# Altium project TC-temp-logger-base.PrjPcb (part 2 of 2)

## Sheet 4-Ethernet.SchDoc: Thermocouple Temperature Logger
size A4; Date: 14.03.2026; Author: MG & JK; Revision: 1-0; SheetNumber: 4; SheetTotal: 7; Model: Rev 1.0; PageSetup: Record=PageOptions|CenterHorizontal=True|CenterVertical=True|PrintScale=0.52|XCorrection=1.00|YCorrection=1.00|PrintKind=1|BorderSize=5000000|LeftOffset=0|BottomOffset=0|Orientation=2|PaperLength=4200|PaperWidth=2970|Scale=100|PaperSource=7|PrintQuality=600|MediaType=1|DitherType=10|PaperKind=A3|PrintScaleMode=1
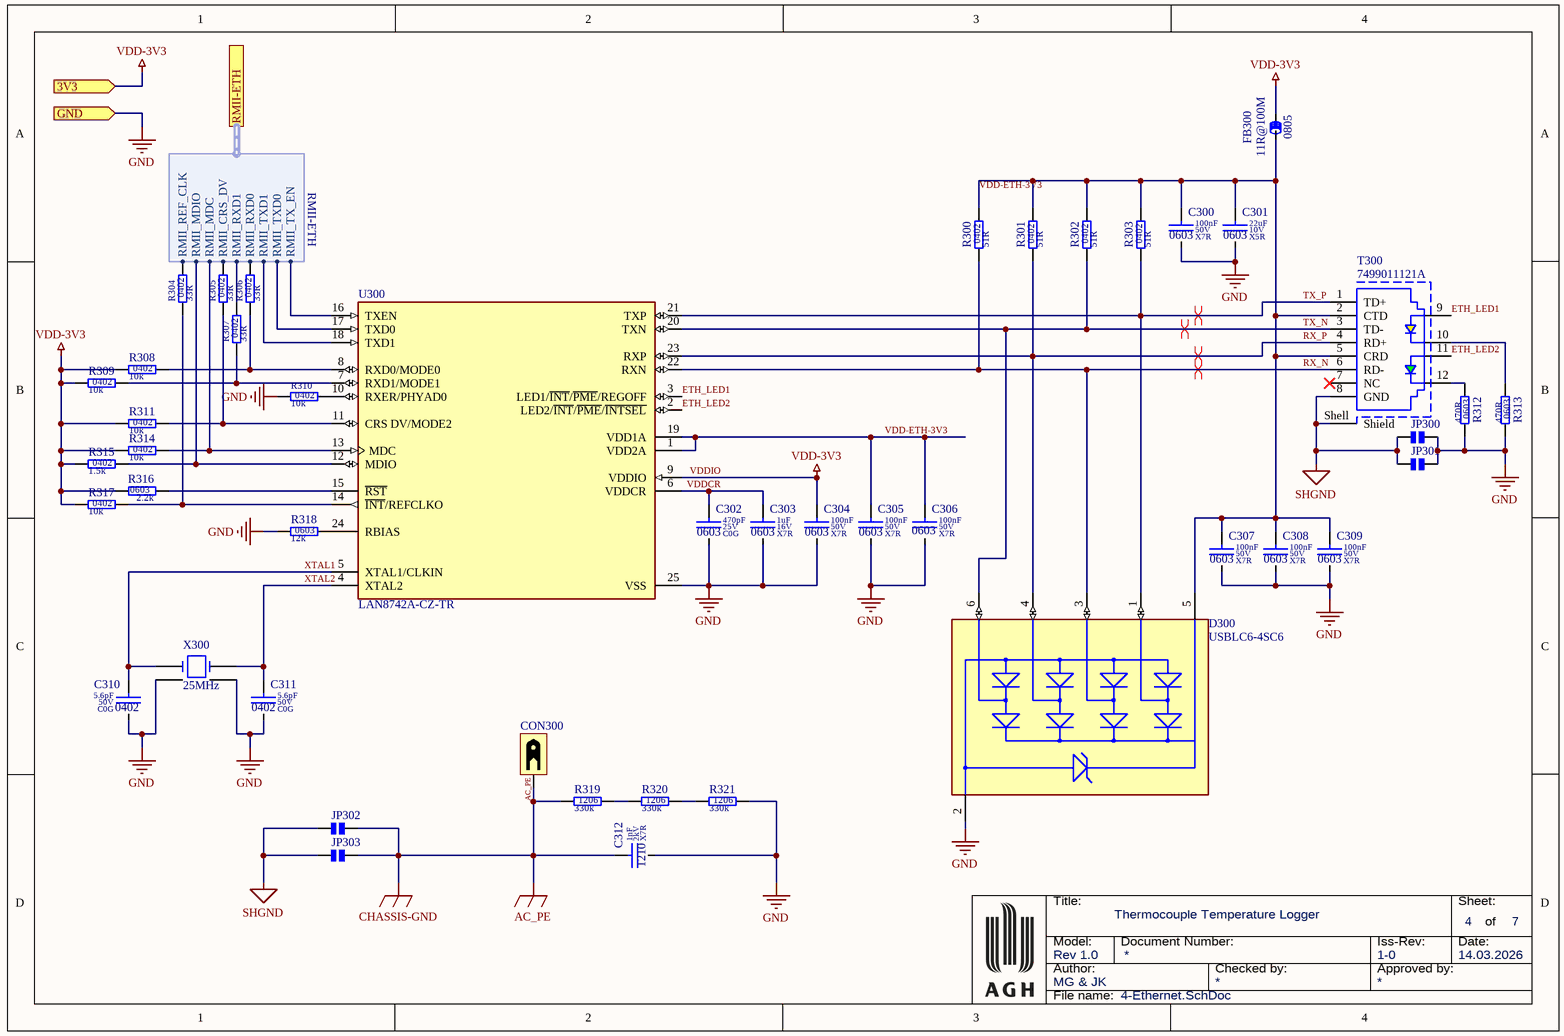
[diagram p3: 4-Ethernet.SchDoc]

### Parts
C300  value 100nF  Dielectric: X7R  Voltage: 50V  SCH_Footprint: 0603  [C_0603_1608]  (hidden comment: Ceramic X7R)
C301  value 22uF  Dielectric: X5R  Voltage: 10V  SCH_Footprint: 0603  [C_0603_1608]  (hidden comment: Ceramic X5R)
C302  value 470pF  Dielectric: C0G  Voltage: 25V  SCH_Footprint: 0603  [C_0603_1608]  (hidden comment: Ceramic C0G)
C303  value 1uF  Dielectric: X7R  Voltage: 16V  SCH_Footprint: 0603  [C_0603_1608]  (hidden comment: Ceramic X7R)
C304  value 100nF  Dielectric: X7R  Voltage: 50V  SCH_Footprint: 0603  [C_0603_1608]  (hidden comment: Ceramic X7R)
C305  value 100nF  Dielectric: X7R  Voltage: 50V  SCH_Footprint: 0603  [C_0603_1608]  (hidden comment: Ceramic X7R)
C306  value 100nF  Dielectric: X7R  Voltage: 50V  SCH_Footprint: 0603  [C_0603_1608]  (hidden comment: Ceramic X7R)
C307  value 100nF  Dielectric: X7R  Voltage: 50V  SCH_Footprint: 0603  [C_0603_1608]  (hidden comment: Ceramic X7R)
C308  value 100nF  Dielectric: X7R  Voltage: 50V  SCH_Footprint: 0603  [C_0603_1608]  (hidden comment: Ceramic X7R)
C309  value 100nF  Dielectric: X7R  Voltage: 50V  SCH_Footprint: 0603  [C_0603_1608]  (hidden comment: Ceramic X7R)
C310  value 5.6pF  Dielectric: C0G  Voltage: 50V  SCH_Footprint: 0402  [C_0402_1005]  (hidden comment: Ceramic C0G)
C311  value 5.6pF  Dielectric: C0G  Voltage: 50V  SCH_Footprint: 0402  [C_0402_1005]  (hidden comment: Ceramic C0G)
C312  value 1nF  Dielectric: X7R  Voltage: 2kV  SCH_Footprint: 1210  [C_1210_3225]  (hidden comment: Ceramic X7R)
CON300  Terminal for PE  [TP_1-726388-2]  (value not drawn)
D300  USBLC6-4SC6  [FP-SOT23-6L-MFG]
FB300  value 11R@100M  SCH_Footprint: 0805  [FB_0805_2012]  (hidden comment: Ferrite bead)
JP300  Solder Jumper 0603/1608  [JP_0603_1608]  (value not drawn)
JP301  Solder Jumper 0603/1608  [JP_0603_1608]  (value not drawn)
JP302  Solder Jumper 0603/1608  [JP_0603_1608]  (value not drawn)
JP303  Solder Jumper 0603/1608  [JP_0603_1608]  (value not drawn)
R300  value 51R  SCH_Footprint: 0402  [R_0402_1005]  (hidden comment: Resistor)
R301  value 51R  SCH_Footprint: 0402  [R_0402_1005]  (hidden comment: Resistor)
R302  value 51R  SCH_Footprint: 0402  [R_0402_1005]  (hidden comment: Resistor)
R303  value 51R  SCH_Footprint: 0402  [R_0402_1005]  (hidden comment: Resistor)
R304  value 33R  SCH_Footprint: 0402  [R_0402_1005]  (hidden comment: Resistor)
R305  value 33R  SCH_Footprint: 0402  [R_0402_1005]  (hidden comment: Resistor)
R306  value 33R  SCH_Footprint: 0402  [R_0402_1005]  (hidden comment: Resistor)
R307  value 33R  SCH_Footprint: 0402  [R_0402_1005]  (hidden comment: Resistor)
R308  value 10k  SCH_Footprint: 0402  [R_0402_1005]  (hidden comment: Resistor)
R309  value 10k  SCH_Footprint: 0402  [R_0402_1005]  (hidden comment: Resistor)
R310  value 10k  SCH_Footprint: 0402  [R_0402_1005]  (hidden comment: Resistor)
R311  value 10k  SCH_Footprint: 0402  [R_0402_1005]  (hidden comment: Resistor)
R312  value 470R  SCH_Footprint: 0603  [R_0603_1608]  (hidden comment: Resistor)
R313  value 470R  SCH_Footprint: 0603  [R_0603_1608]  (hidden comment: Resistor)
R314  value 10k  SCH_Footprint: 0402  [R_0402_1005]  (hidden comment: Resistor)
R315  value 1.5k  SCH_Footprint: 0402  [R_0402_1005]  (hidden comment: Resistor)
R316  value 2.2k  SCH_Footprint: 0603  [R_0603_1608]  (hidden comment: Resistor)
R317  value 10k  SCH_Footprint: 0402  [R_0402_1005]  (hidden comment: Resistor)
R318  value 12k  SCH_Footprint: 0603  [R_0603_1608]  (hidden comment: Resistor)
R319  value 330k  SCH_Footprint: 1206  [R_1206_3216]  (hidden comment: Resistor)
R320  value 330k  SCH_Footprint: 1206  [R_1206_3216]  (hidden comment: Resistor)
R321  value 330k  SCH_Footprint: 1206  [R_1206_3216]  (hidden comment: Resistor)
T300  7499011121A  [7499011121A]
U300  LAN8742A-CZ-TR  [FP-C04-143B-S4QFN-MFG]
X300  value 25MHz  [X_2x1.6_4PIN]  (hidden comment: 32 MHz Oscilator)

### Ports
3V3 (in, see 1-Block-diagram[4A], 2-STM32H563[2A], 3-Power-Supply[2D], 5-SD-Card[1A], 6-Connectors[1A]), GND (in, see 1-Block-diagram[4A], 2-STM32H563[2A], 3-Power-Supply[3A], 5-SD-Card[1A], 6-Connectors[1A], 7-LTC2983[1A]), RMII-ETH (harness RMII-ETH, see 1-Block-diagram[4A], 2-STM32H563[1A])

### Harnesses
RMII-ETH: RMII_TX_EN, RMII_TXD0, RMII_TXD1, RMII_RXD0, RMII_RXD1, RMII_CRS_DV, RMII_MDC, RMII_MDIO, RMII_REF_CLK

### Nets
AC_PE: C312.1 CON300.1(TP) JP302.2 JP303.2 R319.1  [also labelled CHASSIS-GND]
GND: C300.2 C301.2 C302.2 C303.2 C304.2 C305.2 C306.2 C307.2 C308.2 C309.2 C310.2 C311.2 C312.2 D300.2(GND) JP300.2 JP301.2 R310.1 R312.1 R313.1 R318.1 R321.2 U300.25(VSS) X300.2(GND) X300.4(GND) ; port GND
SHGND: JP300.1 JP301.1 JP302.1 JP303.1 T300.8(GND) T300.Shell(Shield)
VDD-3V3: C304.1 FB300.1 R308.1 R309.1 R311.1 R314.1 R315.1 R316.2 R317.1 U300.9(VDDIO) ; port 3V3  [also labelled VDDIO]
ETH_LED1: T300.9 U300.3(LED1/~{INT}/~{PME}/REGOFF)  [project net ETH_LED1_4]
ETH_LED2: T300.11 U300.2(LED2/~{INT}/~{PME}/~{INTSEL})  [project net ETH_LED2_4]
RMII_CRS_DV: R305.2 ; port RMII-ETH.RMII_CRS_DV
RMII_MDC: R314.2 U300.13(MDC) ; port RMII-ETH.RMII_MDC
RMII_MDIO: R315.2 U300.12(MDIO) ; port RMII-ETH.RMII_MDIO
RMII_REF_CLK: R304.2 ; port RMII-ETH.RMII_REF_CLK
RMII_RXD0: R306.2 ; port RMII-ETH.RMII_RXD0
RMII_RXD1: R307.2 ; port RMII-ETH.RMII_RXD1
RMII_TX_EN: U300.16(TXEN) ; port RMII-ETH.RMII_TX_EN
RX_N: D300.3(I/O2) R300.1 T300.6(RD-) U300.22(RXN)  [project net RX_N_4]
RX_P: D300.4(I/O3) R301.1 T300.4(RD+) U300.23(RXP)  [project net RX_P_4]
TX_N: D300.6(I/O4) R302.1 T300.3(TD-) U300.20(TXN)  [project net TX_N_4]
TX_P: D300.1(I/O1) R303.1 T300.1(TD+) U300.21(TXP)  [project net TX_P_4]
VDD-ETH-3V3: C300.1 C301.1 C305.1 C306.1 C307.1 C308.1 C309.1 D300.5(VBUS) FB300.2 R300.2 R301.2 R302.2 R303.2 T300.2(CTD) T300.5(CRD) U300.1(VDD2A) U300.19(VDD1A)  [project net VDD-ETH-3V3_4]
VDDCR: C302.1 C303.1 U300.6(VDDCR)  [project net VDDCR_4]
XTAL1: C310.1 U300.5(XTAL1/CLKIN) X300.3  [project net XTAL1_4]
XTAL2: C311.1 U300.4(XTAL2) X300.1  [project net XTAL2_4]
NetR104_1: U300.17(TXD0) ; port RMII-ETH.RMII_TXD0
NetR105_1: U300.18(TXD1) ; port RMII-ETH.RMII_TXD1
NetR304_1: R304.1 R317.2 U300.14(~{INT}/REFCLKO)
NetR305_1: R305.1 R311.2 U300.11(CRS_DV/MODE2)
NetR306_1: R306.1 R308.2 U300.8(RXD0/MODE0)
NetR307_1: R307.1 R309.2 U300.7(RXD1/MODE1)
NetR310_2: R310.2 U300.10(RXER/PHYAD0)
NetR312_2: R312.2 T300.12
NetR313_2: R313.2 T300.10
NetR316_1: R316.1 U300.15(~{RST})
NetR318_2: R318.2 U300.24(RBIAS)
NetR319_2: R319.2 R320.1
NetR320_2: R320.2 R321.1

Not connected (* = marked no-connect by the designer): T300 7(NC)*

### Layout directives
differential pair: RX_N_4, RX_P_4, TX_N_4, TX_P_4

### Notes on the sheet
- Title:
- Sheet:
- of
- Author:
- Model:
- Document Number:
- Checked by:
- Iss-Rev:
- Approved by:
- Date:
- File name:

### Library data of the parts
C300 C304-C309 = C_100nF_50V_X7R_0603_10_AECQ1: as C100 on sheet 2-STM32H563; Part Number: C_100nF_50V_X7R_0603_10_AECQ1; HelpURL: https://www.murata.com/products/productdetail?partno=GCM188R71H104KA57%23; Supplier 1: TME; Supplier Part Number 1: GCM188R71H104KA57D; Supplier 2: RS Components; Supplier 3: Farnell; Supplier Part Number 3: 4360223; Supplier 4: Mouser; Supplier Part Number 4: 81-GCM188R71H104KA7D; Supplier 5: Digi-Key; Supplier Part Number 5: 490-4779-1-ND; Supplier 6: LCSC; Supplier Part Number 6: C85864
C301 = C_22uF_10V_X5R_0603_20: as C109 on sheet 2-STM32H563; Part Number: C_22uF_10V_X5R_0603_20; HelpURL: https://www.mouser.pl/datasheet/2/281/1/GRM188R61A226ME15_02A-1985787.pdf; Supplier 1: TME; Supplier Part Number 1: GRM188R61A226ME15D; Supplier 2: RS Components; Supplier 3: Farnell; Supplier Part Number 3: 2426957; Supplier 4: Mouser; Supplier Part Number 4: 81-GRM188R61A226ME5D; Supplier 5: Digi-Key; Supplier Part Number 5: 490-10476-1-ND; Supplier 6: LCSC
C302 = C_470pF_25V_C0G_0603_5: Capacitor; Manufacturer: Wurth Elektronik; Manufacturer Part Number: 885012006042; Tolerance (%): 5; Part Number: C_470pF_25V_C0G_0603_5; HelpURL: https://www.we-online.com/components/products/datasheet/885012006042.pdf; Supplier 1: TME; Supplier 2: RS Components; Supplier 3: Farnell; Supplier Part Number 3: 2533843; Supplier 4: Mouser; Supplier Part Number 4: 710-885012006042; Supplier 5: Digi-Key; Supplier Part Number 5: 732-7784-1-ND; Supplier 6: LCSC
C303 = C_1uF_16V_X7R_0603_10: Capacitor; Manufacturer: Wurth Elektronik; Manufacturer Part Number: 885012206052; Tolerance (%): 10; Part Number: C_1uF_16V_X7R_0603_10; HelpURL: https://www.we-online.com/components/products/datasheet/885012206052.pdf; Supplier 1: TME; Supplier 2: RS Components; Supplier Part Number 2: 71070543; Supplier 3: Farnell; Supplier Part Number 3: 2495171; Supplier 4: Mouser; Supplier Part Number 4: 710-885012206052; Supplier 5: Digi-Key; Supplier Part Number 5: 732-7971-1-ND; Supplier 6: LCSC
C310 C311 = C_5.6pF_50V_C0G_0402_2_AECQ1: Capacitor; Manufacturer: Murata; Manufacturer Part Number: GCM1555C1H5R6BA16D; Tolerance (%): 2; AEC-Q: 1; Part Number: C_5.6pF_50V_C0G_0402_2_AECQ1; HelpURL: https://www.murata.com/products/productdetail?partno=GCM1555C1H5R6BA16%23; Supplier 1: TME; Supplier Part Number 1: GCM1555C1H5R6BA16D; Supplier 2: RS Components; Supplier 3: Farnell; Supplier Part Number 3: 3581200; Supplier 4: Mouser; Supplier Part Number 4: 81-GCM1555C1H5R6BA6D; Supplier 5: Digi-Key; Supplier Part Number 5: 490-14424-1-ND; Supplier 6: LCSC; Supplier Part Number 6: C415376
C312 = C_1nF_2kV_X7R_1210_10: Capacitor; Manufacturer: AVX; Manufacturer Part Number: 1210GC102KAT1A; Tolerance (%): 10; Part Number: C_1nF_2kV_X7R_1210_10; HelpURL: http://www.tme.eu/pl/Document/667fe6e7748c0ed1675574c6bf64b751/AVX_X7R.pdf; Supplier 1: TME; Supplier Part Number 1: 1210GC102KAT1A; Supplier 2: RS Components; Supplier 3: Farnell; Supplier 4: Mouser; Supplier 5: Digi-Key; Supplier 6: LCSC
CON300 = TP_TERMINAL_1-726388-2: Terminal; Manufacturer: TE Connectivity; SCH_Footprint: THT; Value: 1-726388-2; Part Number: TP_TERMINAL_1-726388-2; HelpURL: https://datasheet.octopart.com/1-726388-2-TE-Connectivity-datasheet-13534909.pdf; Manufacturer Part Number: 1-726388-2; Supplier 1: TME; Supplier Part Number 1: 1-726388-2; Supplier 2: RS Components; Supplier Part Number 2: 6805772; Supplier 3: Farnell; Supplier Part Number 3: 2308760; Supplier 4: Mouser; Supplier Part Number 4: 571-1-726388-2; Supplier 5: Digi-Key; Supplier Part Number 5: 1-726388-2-ND; Supplier 6: LCSC
D300 = CMP-2000-07370-2: TVS DIODE 5.25V 17V SOT23-6; Manufacturer: STMicroelectronics; Peak Pulse Power: 130W; Breakdown Voltage: 6V; Value: 3pF; Direction: Unidirectional; Interface: USB,Ethernet,Other; Number Of Channels: 4; Standoff Height: 0mm; Max Junction Temp: +125°C; Digikey Description: TVS DIODE 5.25V 17V SOT23-6; Automotive: No; Package: SOT23-6L; Mouser Description: USBLC6 Series 4 Line 6 V Uni / Bi-Directional ESD Protection - SOT-23-6; Octopart: https://octopart.com/usblc6-4sc6-stmicroelectronics-347147; RoHS: TRUE; ComponentLink2URL: https://upverter.com/datasheet/23dc4ffb028d868909e80577610284b194f13213.pdf; ComponentLink2Description: Datasheet; Device Class L1: Circuit Protection; Lead Free: Yes; Temperature Range High: +125°C; Device Class L2: ESD and Circuit Protection ICs; Device Class L3: unset; Capacitance: 3pF; Height: 1.45mm; Temperature Range Low: -40°C; Manufacturer Part Number: USBLC6-4SC6; Temperature: -40°C to +125°C; Category: Diode; Clamping Voltage: 17V
FB300 = FB_2508051107Y0: as FB100 on sheet 2-STM32H563; Part Number: FB_2508051107Y0; HelpURL: https://datasheet.octopart.com/2508051107Y0-Fair-Rite-datasheet-834.pdf; Manufacturer Part Number: 2508051107Y0; Supplier 1: TME; Supplier 2: RS Components; Supplier 3: Farnell; Supplier Part Number 3: 1612004; Supplier 4: Mouser; Supplier Part Number 4: 623-2508051107Y0; Supplier 5: Digi-Key; Supplier Part Number 5: 1934-1397-1-ND; Supplier 6: LCSC
JP300-JP303 = JP_0603_1608: SCH_Footprint: 0603; Value: -; Part Number: JP_0603_1608; HelpURL: -; Manufacturer: -; Manufacturer Part Number: -; Supplier 1: TME; Supplier 2: RS Components; Supplier 3: Farnell; Supplier 4: Mouser; Supplier 5: Digi-Key; Supplier 6: LCSC
R300-R303 = R_51R_0402_1_AECQ0: Manufacturer: Panasonic; Manufacturer Part Number: ERJ-2RKF51R0X; Voltage: 50V; Power: 100mW; Tolerance: 1%; AEC-Q: 0; Part Number: R_51R_0402_1_AECQ0; HelpURL: https://industrial.panasonic.com/cdbs/www-data/pdf/RDA0000/AOA0000C304.pdf; Supplier 1: TME; Supplier Part Number 1: ERJ2RKF51R0X; Supplier 2: RS Components; Supplier 3: Farnell; Supplier Part Number 3: 2302492; Supplier 4: Mouser; Supplier Part Number 4: 667-ERJ-2RKF51R0X; Supplier 5: Digi-Key; Supplier Part Number 5: P51.0LCT-ND; Supplier 6: LCSC
R304-R307 = R_33R_0402_1_AECQ0: Manufacturer: Panasonic; Manufacturer Part Number: ERJ-2RKF33R0X; Voltage: 50V; Power: 100mW; Tolerance: 1%; AEC-Q: 0; Part Number: R_33R_0402_1_AECQ0; HelpURL: https://industrial.panasonic.com/cdbs/www-data/pdf/RDA0000/AOA0000C304.pdf; Supplier 1: TME; Supplier Part Number 1: ERJ2RKF33R0X; Supplier 2: RS Components; Supplier 3: Farnell; Supplier Part Number 3: 2302472; Supplier 4: Mouser; Supplier Part Number 4: 667-ERJ-2RKF33R0X; Supplier 5: Digi-Key; Supplier Part Number 5: P33.0LCT-ND; Supplier 6: LCSC; Supplier Part Number 6: C278594
R308-R311 R314 R317 = R_10k_0402_1: Manufacturer: Yageo; Manufacturer Part Number: RC0402FR-0710KL; Voltage: 50V; Power: 63mW; Tolerance: 1%; Part Number: R_10k_0402_1; HelpURL: http://www.tme.eu/pl/Document/1a2bc76e2be68b3b1670068306778ce6/rc0402yageo.pdf; Supplier 1: TME; Supplier Part Number 1: RC0402FR-0710K; Supplier 2: RS Components; Supplier 3: Farnell; Supplier 4: Mouser; Supplier 5: Digi-Key; Supplier 6: LCSC
R312 R313 = R_470R_0603_1: Manufacturer: Yageo; Manufacturer Part Number: RC0603FR-07470RL; Voltage: 50V; Power: 100mW; Tolerance: 1%; Part Number: R_470R_0603_1; HelpURL: http://www.tme.eu/en/Document/9fef8ccbb584e9f6a1c931cf356afd5c/PYu-RC0603_51_RoHS_L_4.pdf; Supplier 1: TME; Supplier Part Number 1: RC0603FR-07470R; Supplier 2: RS Components; Supplier 3: Farnell; Supplier Part Number 3: 9238441; Supplier 4: Mouser; Supplier Part Number 4: 603-RC0603FR-07470RL; Supplier 5: Digi-Key; Supplier Part Number 5: 311-470HRCT-ND; Supplier 6: LCSC
R315 = R_1.5k_0402_1_AECQ0: Manufacturer: Panasonic; Manufacturer Part Number: ERJ-2RKF1501X; Voltage: 50V; Power: 100mW; Tolerance: 1%; AEC-Q: 0; Part Number: R_1.5k_0402_1_AECQ0; HelpURL: https://industrial.panasonic.com/cdbs/www-data/pdf/RDA0000/AOA0000C304.pdf; Supplier 1: TME; Supplier Part Number 1: ERJ2RKF1501X; Supplier 2: RS Components; Supplier 3: Farnell; Supplier Part Number 3: 2302656; Supplier 4: Mouser; Supplier Part Number 4: 667-ERJ-2RKF1501X; Supplier 5: Digi-Key; Supplier Part Number 5: P1.50KLCT-ND; Supplier 6: LCSC
R316 = R_2.2k_0603_1: Manufacturer: Yageo; Manufacturer Part Number: RC0603FR-072K2L; Voltage: 50V; Power: 100mW; Tolerance: 1%; Part Number: R_2.2k_0603_1; HelpURL: https://datasheet.octopart.com/RC0603FR-072K2L-Yageo-datasheet-8328172.pdf; Supplier 1: TME; Supplier Part Number 1: RC0603FR-072K2; Supplier 2: RS Components; Supplier 3: Farnell; Supplier Part Number 3: 9238522; Supplier 4: Mouser; Supplier Part Number 4: 603-RC0603FR-072K2L; Supplier 5: Digi-Key; Supplier Part Number 5: 311-2.20KHRCT-ND; Supplier 6: LCSC
R318 = R_12k_0603_1: Manufacturer: Yageo; Manufacturer Part Number: RC0603FR-0712KL; Voltage: 50V; Power: 100mW; Tolerance: 1%; Part Number: R_12k_0603_1; HelpURL: http://www.tme.eu/pl/Document/d2a72e545e5c8eb7bf2a04fa97535928/rc0603yageo.pdf; Supplier 1: TME; Supplier Part Number 1: RC0603FR-0712K; Supplier 2: RS Components; Supplier 3: Farnell; Supplier Part Number 3: 2693657; Supplier 4: Mouser; Supplier Part Number 4: 603-RC0603FR-0712KL; Supplier 5: Digi-Key; Supplier Part Number 5: 311-12.0KHRCT-ND; Supplier 6: LCSC
R319-R321 = R_330k_1206_1: Manufacturer: Yageo; Manufacturer Part Number: RC1206FR-07330KL; Voltage: 200V; Power: 250mW; Tolerance: 1%; Part Number: R_330k_1206_1; HelpURL: https://datasheet.octopart.com/RC1206FR-07330KL-Yageo-datasheet-8359522.pdf; Supplier 1: TME; Supplier Part Number 1: RC1206FR-07330KL; Supplier 2: RS Components; Supplier Part Number 2: 1995833; Supplier 3: Farnell; Supplier Part Number 3: 9241094; Supplier 4: Mouser; Supplier Part Number 4: 603-RC1206FR-07330KL; Supplier 5: Digi-Key; Supplier Part Number 5: 311-330KFRCT-ND; Supplier 6: LCSC
T300 = 7499011121A: WE-RJ45 LAN Transformer, THT, 10/100 Base-T, Tab Down, 1 Port; Manufacturer: Wurth Elektronik; LED: yellow-green; Number of Ports: 1; PoE: non-PoE; Shield Tabs: Yes; USB: No USB; Manufacturer Part Number: 7499011121A; Category: Filtered Connectors; Match Code: WE-RJ45 LAN; ComponentLink1Description: Website Link; ComponentLink1URL: https://www.we-online.com/redexpert/article/7499011121A?ad; ComponentLink2Description: Datasheet Link; ComponentLink2URL: https://www.we-online.com/redexpert/spec/7499011121A?ad; Mount: Through Hole; Min Operating Temperature: -40°C; Max Operating Temperature: 85°C; Packaging: Tube; Length: 21.84mm; Width: 15.88mm; Height: 13.74mm; Data Rate: 10/100 Base-T; Tab: Down
U300 = CMP-06281-000006-2: IC TRANSCEIVER 1/1 24SQFN; Manufacturer: Microchip; Nominal Supply Current: 6.5-59mA; Max Supply Voltage: 3.6V; Number Of Channels: 1; Data Rate: 100Mbits/s; Interface: Ethernet,Other; Min Supply Voltage: 1.14V; Standoff Height: 0mm; Simplex Duplex: Full-Duplex; Height: 1mm; Ambient Temperature Range High: +70°C; Category: IC; Mouser Description: Small Footprint RMII 10/100 Ethernet Transceiver with flexPWR Technology; Manufacturer Part Number: LAN8742A-CZ-TR; Digikey Description: IC TRANSCEIVER 1/1 24SQFN; Octopart: https://octopart.com/lan8742a-cz-tr-microchip-29030587; Temperature: 0°C to +70°C; Ambient Temperature Range Low: 0°C; Temperature Range Low: 0°C; ComponentLink2Description: Datasheet; Automotive: No; RoHS: TRUE; Device Class L3: Ethernet Interface ICs; Device Class L1: Integrated Circuits (ICs); Device Class L2: Interface ICs; Lead Free: Yes; Ipc Land Pattern Name: QFN50P400X400X90-24; ComponentLink2URL: http://ww1.microchip.com/downloads/en/DeviceDoc/DS_LAN8742_00001989A.pdf; Temperature Range High: +70°C; Package: C04-143B-S4QFN
X300 = X_NX2016SA-32M-EXS00A-CS06465: Part Number: NX2016SA-25.000M-STD-CZS-1; Manufacturer: NDK; SCH_Footprint: x1.6; Manufacturer Part Number: NX2016SA-25.000M-STD-CZS-1; HelpURL: https://pl.mouser.com/datasheet/2/905/ndk_08142018_NX2016SA-32M-EXS00A-CS06465_SS-1389053.pdf; Supplier 1: TME; Supplier 2: RS Components; Supplier 3: Farnell; Supplier 4: Mouser; Supplier Part Number 4: 344-NX2016SA32S06465; Supplier 5: Digi-Key; Supplier Part Number 5: 644-1300-1-ND; Supplier 6: LCSC

## Sheet 5-SD-Card.SchDoc: Thermocouple Temperature Logger
size A4; Date: 14.03.2026; Author: MG & JK; Revision: 1-0; SheetNumber: 5; SheetTotal: 7; Model: Rev 1.0; PageSetup: Record=PageOptions|CenterHorizontal=True|CenterVertical=True|PrintScale=0.52|XCorrection=1.00|YCorrection=1.00|PrintKind=1|BorderSize=5000000|LeftOffset=0|BottomOffset=0|Orientation=2|PaperLength=4200|PaperWidth=2970|Scale=100|PaperSource=7|PrintQuality=600|MediaType=1|DitherType=10|PaperKind=A3|PrintScaleMode=1
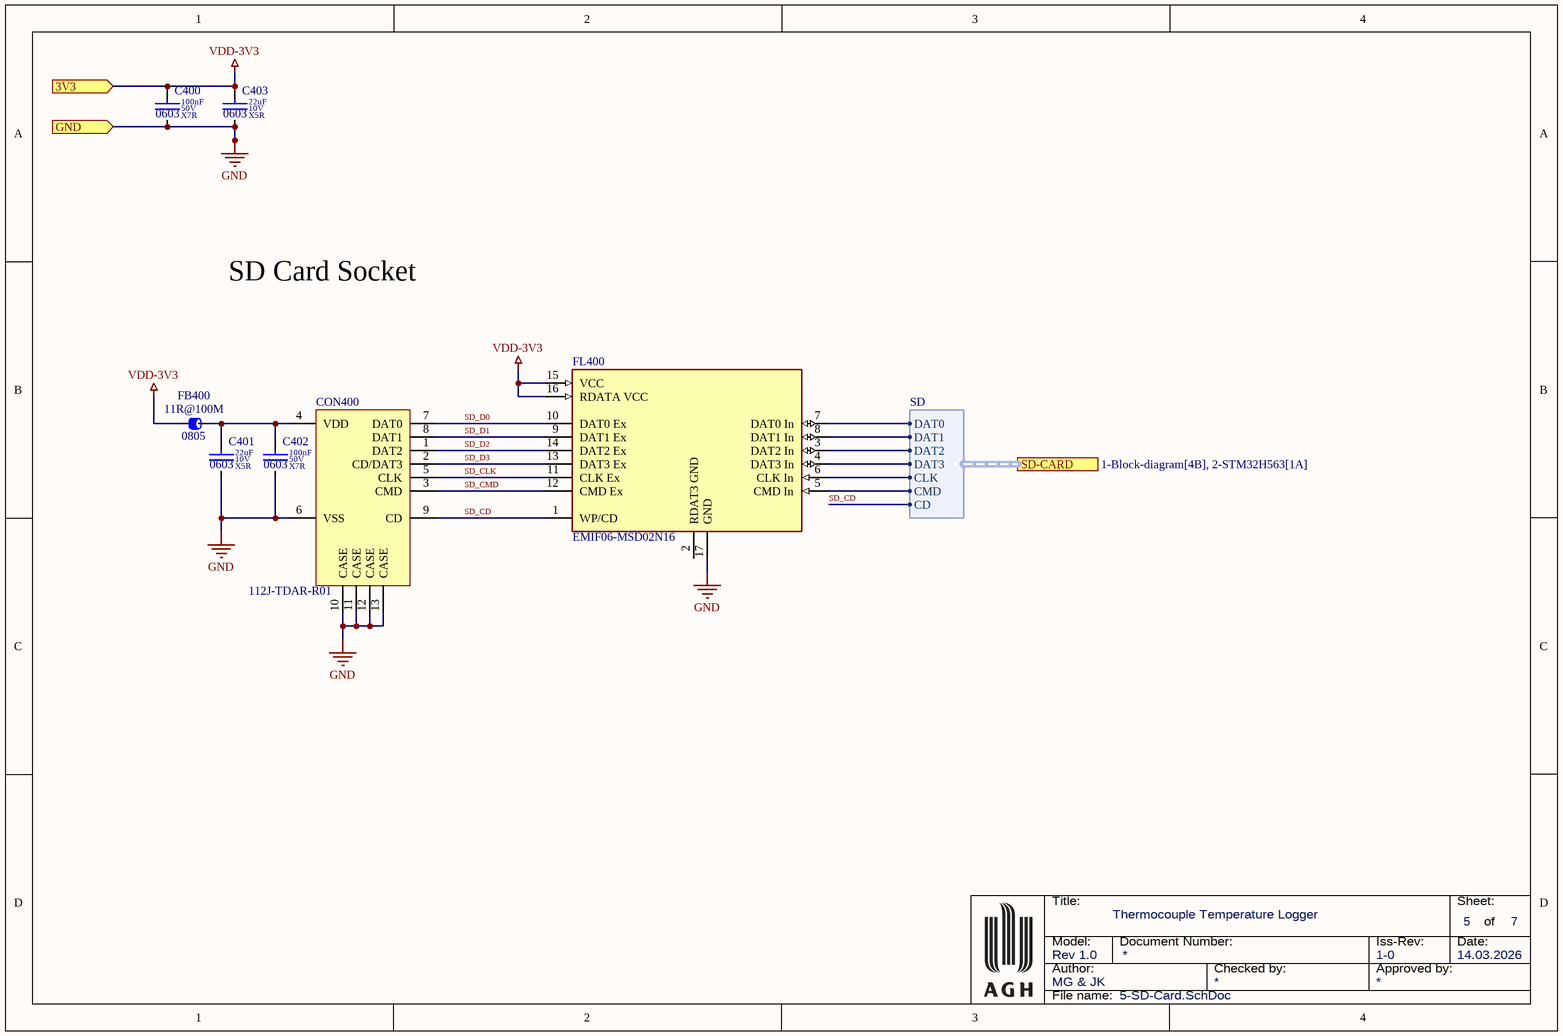
[diagram p4: 5-SD-Card.SchDoc]

### Parts
C400  value 100nF  Dielectric: X7R  Voltage: 50V  SCH_Footprint: 0603  [C_0603_1608]  (hidden comment: Ceramic X7R)
C401  value 22uF  Dielectric: X5R  Voltage: 10V  SCH_Footprint: 0603  [C_0603_1608]  (hidden comment: Ceramic X5R)
C402  value 100nF  Dielectric: X7R  Voltage: 50V  SCH_Footprint: 0603  [C_0603_1608]  (hidden comment: Ceramic X7R)
C403  value 22uF  Dielectric: X5R  Voltage: 10V  SCH_Footprint: 0603  [C_0603_1608]  (hidden comment: Ceramic X5R)
CON400  112J-TDAR-R01  [112J-TDAR-R01]
FB400  value 11R@100M  SCH_Footprint: 0805  [FB_0805_2012]  (hidden comment: Ferrite bead)
FL400  EMIF06-MSD02N16  [FP-EMIF06-MSD02N16-MFG]

### Ports
3V3 (in, see 1-Block-diagram[4B], 2-STM32H563[2A], 3-Power-Supply[2D], 4-Ethernet[1A], 6-Connectors[1A]), GND (in, see 1-Block-diagram[4B], 2-STM32H563[2A], 3-Power-Supply[3A], 4-Ethernet[1A], 6-Connectors[1A], 7-LTC2983[1A]), SD-CARD (harness SD, see 1-Block-diagram[4B], 2-STM32H563[1A])

### Harnesses
SD: DAT0, DAT1, DAT2, DAT3, CLK, CMD, CD

### Nets
GND: C400.2 C401.2 C402.2 C403.2 CON400.6(VSS) CON400.10(CASE) CON400.11(CASE) CON400.12(CASE) CON400.13(CASE) FL400.17(GND) ; port GND
VDD-3V3: C400.1 C403.1 FB400.1 FL400.15(VCC) FL400.16(RDATA_VCC) ; port 3V3
SD_CD: CON400.9(CD) FL400.1(WP/CD) ; port SD-CARD.CD  [project net SD-Detect]
SD_CLK: CON400.5(CLK) FL400.11(CLK_Ex)  [project net SD_CLK_5]
SD_CMD: CON400.3(CMD) FL400.12(CMD_Ex)  [project net SD_CMD_5]
SD_D0: CON400.7(DAT0) FL400.10(DAT0_Ex)  [project net SD_D0_5]
SD_D1: CON400.8(DAT1) FL400.9(DAT1_Ex)  [project net SD_D1_5]
SD_D2: CON400.1(DAT2) FL400.14(DAT2_Ex)  [project net SD_D2_5]
SD_D3: CON400.2(CD/DAT3) FL400.13(DAT3_Ex)  [project net SD_D3_5]
SDMMC1_CK: FL400.6(CLK_In) ; port SD-CARD.CLK
SDMMC1_CMD: FL400.5(CMD_In) ; port SD-CARD.CMD
SDMMC1_D0: FL400.7(DAT0_In) ; port SD-CARD.DAT0
SDMMC1_D1: FL400.8(DAT1_In) ; port SD-CARD.DAT1
SDMMC1_D2: FL400.3(DAT2_In) ; port SD-CARD.DAT2
SDMMC1_D3: FL400.4(DAT3_In) ; port SD-CARD.DAT3
NetC401_1: C401.1 C402.1 CON400.4(VDD) FB400.2

Not connected (* = marked no-connect by the designer): FL400 2(RDAT3_GND)

### Notes on the sheet
- SD Card Socket
- Title:
- Sheet:
- of
- Author:
- Model:
- Document Number:
- Checked by:
- Iss-Rev:
- Approved by:
- Date:
- File name:

### Library data of the parts
C400 C402 = C_100nF_50V_X7R_0603_10_AECQ1: as C100 on sheet 2-STM32H563; Part Number: C_100nF_50V_X7R_0603_10_AECQ1; HelpURL: https://www.murata.com/products/productdetail?partno=GCM188R71H104KA57%23; Supplier 1: TME; Supplier Part Number 1: GCM188R71H104KA57D; Supplier 2: RS Components; Supplier 3: Farnell; Supplier Part Number 3: 4360223; Supplier 4: Mouser; Supplier Part Number 4: 81-GCM188R71H104KA7D; Supplier 5: Digi-Key; Supplier Part Number 5: 490-4779-1-ND; Supplier 6: LCSC; Supplier Part Number 6: C85864
C401 C403 = C_22uF_10V_X5R_0603_20: as C109 on sheet 2-STM32H563; Part Number: C_22uF_10V_X5R_0603_20; HelpURL: https://www.mouser.pl/datasheet/2/281/1/GRM188R61A226ME15_02A-1985787.pdf; Supplier 1: TME; Supplier Part Number 1: GRM188R61A226ME15D; Supplier 2: RS Components; Supplier 3: Farnell; Supplier Part Number 3: 2426957; Supplier 4: Mouser; Supplier Part Number 4: 81-GRM188R61A226ME5D; Supplier 5: Digi-Key; Supplier Part Number 5: 490-10476-1-ND; Supplier 6: LCSC
FB400 = FB_2508051107Y0: as FB100 on sheet 2-STM32H563; Part Number: FB_2508051107Y0; HelpURL: https://datasheet.octopart.com/2508051107Y0-Fair-Rite-datasheet-834.pdf; Manufacturer Part Number: 2508051107Y0; Supplier 1: TME; Supplier 2: RS Components; Supplier 3: Farnell; Supplier Part Number 3: 1612004; Supplier 4: Mouser; Supplier Part Number 4: 623-2508051107Y0; Supplier 5: Digi-Key; Supplier Part Number 5: 1934-1397-1-ND; Supplier 6: LCSC
FL400 = CMP-12221-000004-1: FILTER RC(PI) 45 OHM/20PF SMD; Max Breakdown Voltage: 8V; Number of Channels: 6; Capacitance: 20pF; ESD Protection: Yes; Min Operating Temperature: -30°C; Contact Plating: Gold; Width: 0.047inch; Package Quantity: 1; Length: 3.55mm; Mount: Surface Mount; Breakdown Voltage: 8V; Max Operating Temperature: 85°C; REACH SVHC: No SVHC; Radiation Hardening: No; Depth: 1.25mm; Number of Pins: 16; Height: 0.022inch; Termination: Flat; Packaging: Tape and Reel; Case/Package: QFN; Lead Free: Lead Free

## Sheet 6-Connectors.SchDoc: Thermocouple Temperature Logger
size A4; Date: 14.03.2026; Author: MG & JK; Revision: 1-0; SheetNumber: 6; SheetTotal: 7; Model: Rev 1.0; PageSetup: Record=PageOptions|CenterHorizontal=True|CenterVertical=True|PrintScale=0.52|XCorrection=1.00|YCorrection=1.00|PrintKind=1|BorderSize=5000000|LeftOffset=0|BottomOffset=0|Orientation=2|PaperLength=4200|PaperWidth=2970|Scale=100|PaperSource=7|PrintQuality=600|MediaType=1|DitherType=10|PaperKind=A3|PrintScaleMode=1
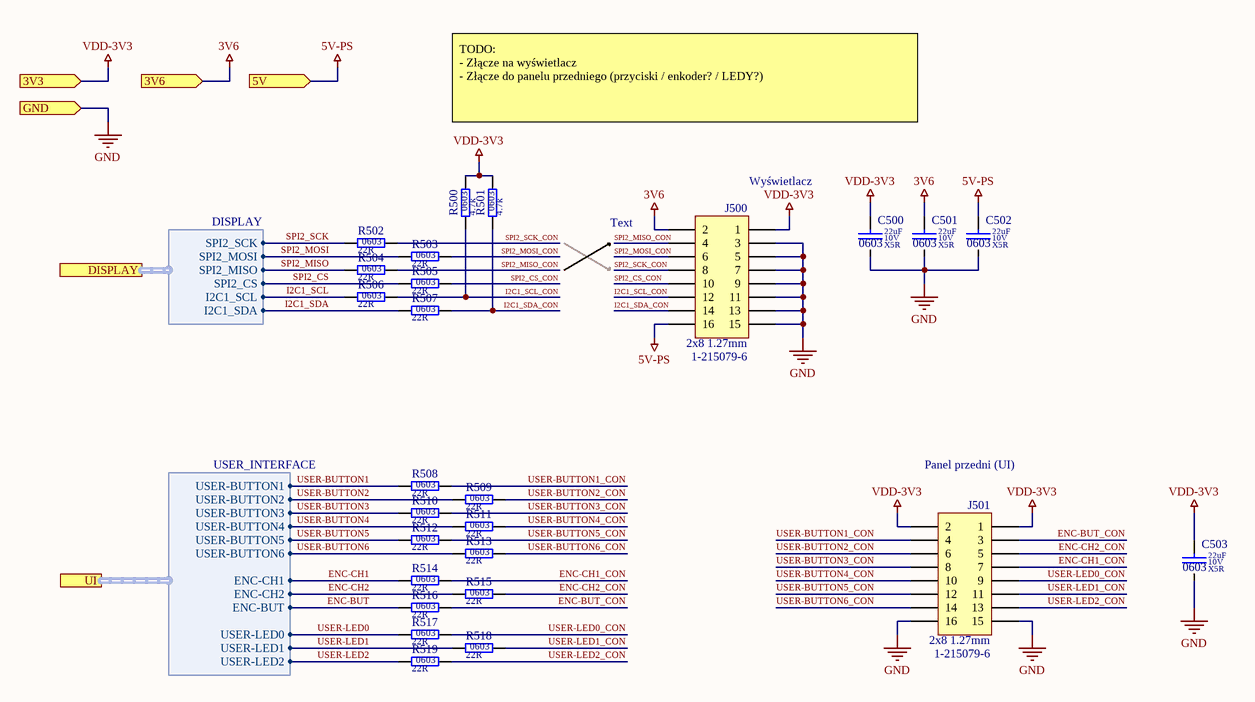
[diagram p5: 6-Connectors.SchDoc]

### Parts
C500  value 22uF  Dielectric: X5R  Voltage: 10V  SCH_Footprint: 0603  [C_0603_1608]  (hidden comment: Ceramic X5R)
C501  value 22uF  Dielectric: X5R  Voltage: 10V  SCH_Footprint: 0603  [C_0603_1608]  (hidden comment: Ceramic X5R)
C502  value 22uF  Dielectric: X5R  Voltage: 10V  SCH_Footprint: 0603  [C_0603_1608]  (hidden comment: Ceramic X5R)
C503  value 22uF  Dielectric: X5R  Voltage: 10V  SCH_Footprint: 0603  [C_0603_1608]  (hidden comment: Ceramic X5R)
J500  value 1-215079-6  SCH_Footprint: 2x8 1.27mm  [J_Micro-Match_2x8_THT]  (hidden comment: Micro-Match 16-pin)
J501  value 1-215079-6  SCH_Footprint: 2x8 1.27mm  [J_Micro-Match_2x8_THT]  (hidden comment: Micro-Match 16-pin)
R500  value 4.7k  SCH_Footprint: 0603  [R_0603_1608]  (hidden comment: Resistor)
R501  value 4.7k  SCH_Footprint: 0603  [R_0603_1608]  (hidden comment: Resistor)
R502  value 22R  SCH_Footprint: 0603  [R_0603_1608]  (hidden comment: Resistor)
R503  value 22R  SCH_Footprint: 0603  [R_0603_1608]  (hidden comment: Resistor)
R504  value 22R  SCH_Footprint: 0603  [R_0603_1608]  (hidden comment: Resistor)
R505  value 22R  SCH_Footprint: 0603  [R_0603_1608]  (hidden comment: Resistor)
R506  value 22R  SCH_Footprint: 0603  [R_0603_1608]  (hidden comment: Resistor)
R507  value 22R  SCH_Footprint: 0603  [R_0603_1608]  (hidden comment: Resistor)
R508  value 22R  SCH_Footprint: 0603  [R_0603_1608]  (hidden comment: Resistor)
R509  value 22R  SCH_Footprint: 0603  [R_0603_1608]  (hidden comment: Resistor)
R510  value 22R  SCH_Footprint: 0603  [R_0603_1608]  (hidden comment: Resistor)
R511  value 22R  SCH_Footprint: 0603  [R_0603_1608]  (hidden comment: Resistor)
R512  value 22R  SCH_Footprint: 0603  [R_0603_1608]  (hidden comment: Resistor)
R513  value 22R  SCH_Footprint: 0603  [R_0603_1608]  (hidden comment: Resistor)
R514  value 22R  SCH_Footprint: 0603  [R_0603_1608]  (hidden comment: Resistor)
R515  value 22R  SCH_Footprint: 0603  [R_0603_1608]  (hidden comment: Resistor)
R516  value 22R  SCH_Footprint: 0603  [R_0603_1608]  (hidden comment: Resistor)
R517  value 22R  SCH_Footprint: 0603  [R_0603_1608]  (hidden comment: Resistor)
R518  value 22R  SCH_Footprint: 0603  [R_0603_1608]  (hidden comment: Resistor)
R519  value 22R  SCH_Footprint: 0603  [R_0603_1608]  (hidden comment: Resistor)

### Ports
3V3 (in, see 1-Block-diagram[4C], 2-STM32H563[2A], 3-Power-Supply[2D], 4-Ethernet[1A], 5-SD-Card[1A]), 3V6 (in, see 1-Block-diagram[4C], 3-Power-Supply[3B], 7-LTC2983[1A]), 5V (in, see 1-Block-diagram[4C], 3-Power-Supply[3A]), DISPLAY (harness DISPLAY, see 1-Block-diagram[4D], 2-STM32H563[1B]), GND (in, see 1-Block-diagram[4C], 2-STM32H563[2A], 3-Power-Supply[3A], 4-Ethernet[1A], 5-SD-Card[1A], 7-LTC2983[1A]), UI (harness USER_INTERFACE, see 1-Block-diagram[4D], 2-STM32H563[1B])

### Harnesses
DISPLAY: SPI2_SCK, SPI2_MOSI, SPI2_MISO, SPI2_CS, I2C1_SCL, I2C1_SDA
USER_INTERFACE: ENC-CH2, ENC-BUT, USER-BUTTON1, USER-BUTTON2, USER-BUTTON3, USER-BUTTON4, USER-BUTTON5, USER-BUTTON6, ENC-CH1, USER-LED2, USER-LED1, USER-LED0

### Nets
3V6: C501.1 J500.2 ; port 3V6
5V-PS: C502.1 J500.16 ; port 5V
GND: C500.2 C501.2 C502.2 C503.2 J500.3 J500.5 J500.7 J500.9 J500.11 J500.13 J500.15 J501.15 J501.16 ; port GND
VDD-3V3: C500.1 C503.1 J500.1 J501.1 J501.2 R500.2 R501.2 ; port 3V3
ENC-BUT: R516.1 ; port UI.ENC-BUT
ENC-BUT_CON: J501.3 R516.2  [project net ENC-BUT_CON_6]
ENC-CH1: R514.1 ; port UI.ENC-CH1
ENC-CH1_CON: J501.7 R514.2  [project net ENC-CH1_CON_6]
ENC-CH2: R515.1 ; port UI.ENC-CH2
ENC-CH2_CON: J501.5 R515.2  [project net ENC-CH2_CON_6]
I2C1_SCL: R506.1 ; port DISPLAY.I2C1_SCL
I2C1_SCL_CON: J500.12 R500.1 R506.2  [project net I2C1_SCL_CON_6]
I2C1_SDA: R507.1 ; port DISPLAY.I2C1_SDA
I2C1_SDA_CON: J500.14 R501.1 R507.2  [project net I2C1_SDA_CON_6]
SPI2_CS: R505.1 ; port DISPLAY.SPI2_CS
SPI2_CS_CON: J500.10 R505.2  [project net SPI2_CS_CON_6]
SPI2_MISO: R504.1 ; port DISPLAY.SPI2_MISO
SPI2_MISO_CON: J500.4 R504.2  [project net SPI2_MISO_CON_6]
SPI2_MOSI: R503.1 ; port DISPLAY.SPI2_MOSI
SPI2_MOSI_CON: J500.6 R503.2  [project net SPI2_MOSI_CON_6]
SPI2_SCK: R502.1 ; port DISPLAY.SPI2_SCK
SPI2_SCK_CON: J500.8 R502.2  [project net SPI2_SCK_CON_6]
USER-BUTTON1: R508.1 ; port UI.USER-BUTTON1
USER-BUTTON1_CON: J501.4 R508.2  [project net USER-BUTTON1_CON_6]
USER-BUTTON2: R509.1 ; port UI.USER-BUTTON2
USER-BUTTON2_CON: J501.6 R509.2  [project net USER-BUTTON2_CON_6]
USER-BUTTON3: R510.1 ; port UI.USER-BUTTON3
USER-BUTTON3_CON: J501.8 R510.2  [project net USER-BUTTON3_CON_6]
USER-BUTTON4: R511.1 ; port UI.USER-BUTTON4
USER-BUTTON4_CON: J501.10 R511.2  [project net USER-BUTTON4_CON_6]
USER-BUTTON5: R512.1 ; port UI.USER-BUTTON5
USER-BUTTON5_CON: J501.12 R512.2  [project net USER-BUTTON5_CON_6]
USER-BUTTON6: R513.1 ; port UI.USER-BUTTON6
USER-BUTTON6_CON: J501.14 R513.2  [project net USER-BUTTON6_CON_6]
USER-LED0: R517.1 ; port UI.USER-LED0
USER-LED0_CON: J501.9 R517.2  [project net USER-LED0_CON_6]
USER-LED1: R518.1 ; port UI.USER-LED1
USER-LED1_CON: J501.11 R518.2  [project net USER-LED1_CON_6]
USER-LED2: R519.1 ; port UI.USER-LED2
USER-LED2_CON: J501.13 R519.2  [project net USER-LED2_CON_6]

### Notes on the sheet
- TODO:
  - Złącze na wyświetlacz
  - Złącze do panelu przedniego (przyciski / enkoder? / LEDY?)
- Text
- (near J500) Wyświetlacz
- Panel przedni (UI)
- Title:
- Sheet:
- of
- Author:
- Model:
- Document Number:
- Checked by:
- Iss-Rev:
- Approved by:
- Date:
- File name:

### Library data of the parts
C500-C503 = C_22uF_10V_X5R_0603_20: as C109 on sheet 2-STM32H563; Part Number: C_22uF_10V_X5R_0603_20; HelpURL: https://www.mouser.pl/datasheet/2/281/1/GRM188R61A226ME15_02A-1985787.pdf; Supplier 1: TME; Supplier Part Number 1: GRM188R61A226ME15D; Supplier 2: RS Components; Supplier 3: Farnell; Supplier Part Number 3: 2426957; Supplier 4: Mouser; Supplier Part Number 4: 81-GRM188R61A226ME5D; Supplier 5: Digi-Key; Supplier Part Number 5: 490-10476-1-ND; Supplier 6: LCSC
J500 J501 = J_Micro-Match_2x8_THT: Pin Header; Manufacturer: TE Connectivity; Part Number: J_Micro-Match_2x8_THT; HelpURL: https://datasheet.octopart.com/1-215079-6-TE-Connectivity-datasheet-11077960.pdf; Manufacturer Part Number: 1-215079-6; Supplier 1: TME; Supplier Part Number 1: AMP-8-215079-6; Supplier 2: RS Components; Supplier Part Number 2: 6804980; Supplier 3: Farnell; Supplier Part Number 3: 1772986; Supplier 4: Mouser; Supplier Part Number 4: 571-1-215079-6; Supplier 5: Digi-Key; Supplier Part Number 5: A110872CT-ND; Supplier 6: LCSC
R500 R501 = R_4.7k_0603_1: Manufacturer: Yageo; Manufacturer Part Number: RC0603FR-074K7L; Voltage: 75V; Power: 100mW; Tolerance: 1%; Part Number: R_4.7k_0603_1; HelpURL: http://www.farnell.com/datasheets/2167052.pdf?_ga=2.156163131.1690599162.1548417389-1379097396.1542296996&_gac=1.18389067.1547230258.Cj0KCQiAmuHhBRD0ARIsAFWyPwhX8HcvXnM3tA0ZBodZLzDIjH2ZxLpjT5LWo9bad_HPRbU8LfPq44UaAhEwEALw_wcB; Supplier 1: TME; Supplier Part Number 1: RC0603FR-074K7; Supplier 2: RS Components; Supplier 3: Farnell; Supplier Part Number 3: 9238565; Supplier 4: Mouser; Supplier Part Number 4: 603-RC0603FR-074K7L; Supplier 5: Digi-Key; Supplier Part Number 5: 311-4.70KHRCT-ND; Supplier 6: LCSC
R502-R519 = R_22R_0603_5: Manufacturer: Walsin; Manufacturer Part Number: WF06P220JTL; Voltage: 50V; Power: 125mW; Tolerance: 5%; Part Number: R_22R_0603_5; HelpURL: http://www.tme.eu/pl/Document/b315665a56acbc42df513c99b390ad98/ROYALOHM-THICKFILM.pdf; Supplier 1: TME; Supplier Part Number 1: WF06P-22R-5%; Supplier 2: RS Components; Supplier 3: Farnell; Supplier 4: Mouser; Supplier 5: Digi-Key; Supplier 6: LCSC

## Sheet 7-LTC2983.SchDoc: Thermocouple Temperature Logger
size A4; Date: 14.03.2026; Author: MG & JK; Revision: 1-0; SheetNumber: 7; SheetTotal: 7; Model: Rev 1.0; PageSetup: Record=PageOptions|CenterHorizontal=True|CenterVertical=True|PrintScale=0.52|XCorrection=1.00|YCorrection=1.00|PrintKind=1|BorderSize=5000000|LeftOffset=0|BottomOffset=0|Orientation=2|PaperLength=4200|PaperWidth=2970|Scale=100|PaperSource=7|PrintQuality=600|MediaType=1|DitherType=10|PaperKind=A3|PrintScaleMode=1
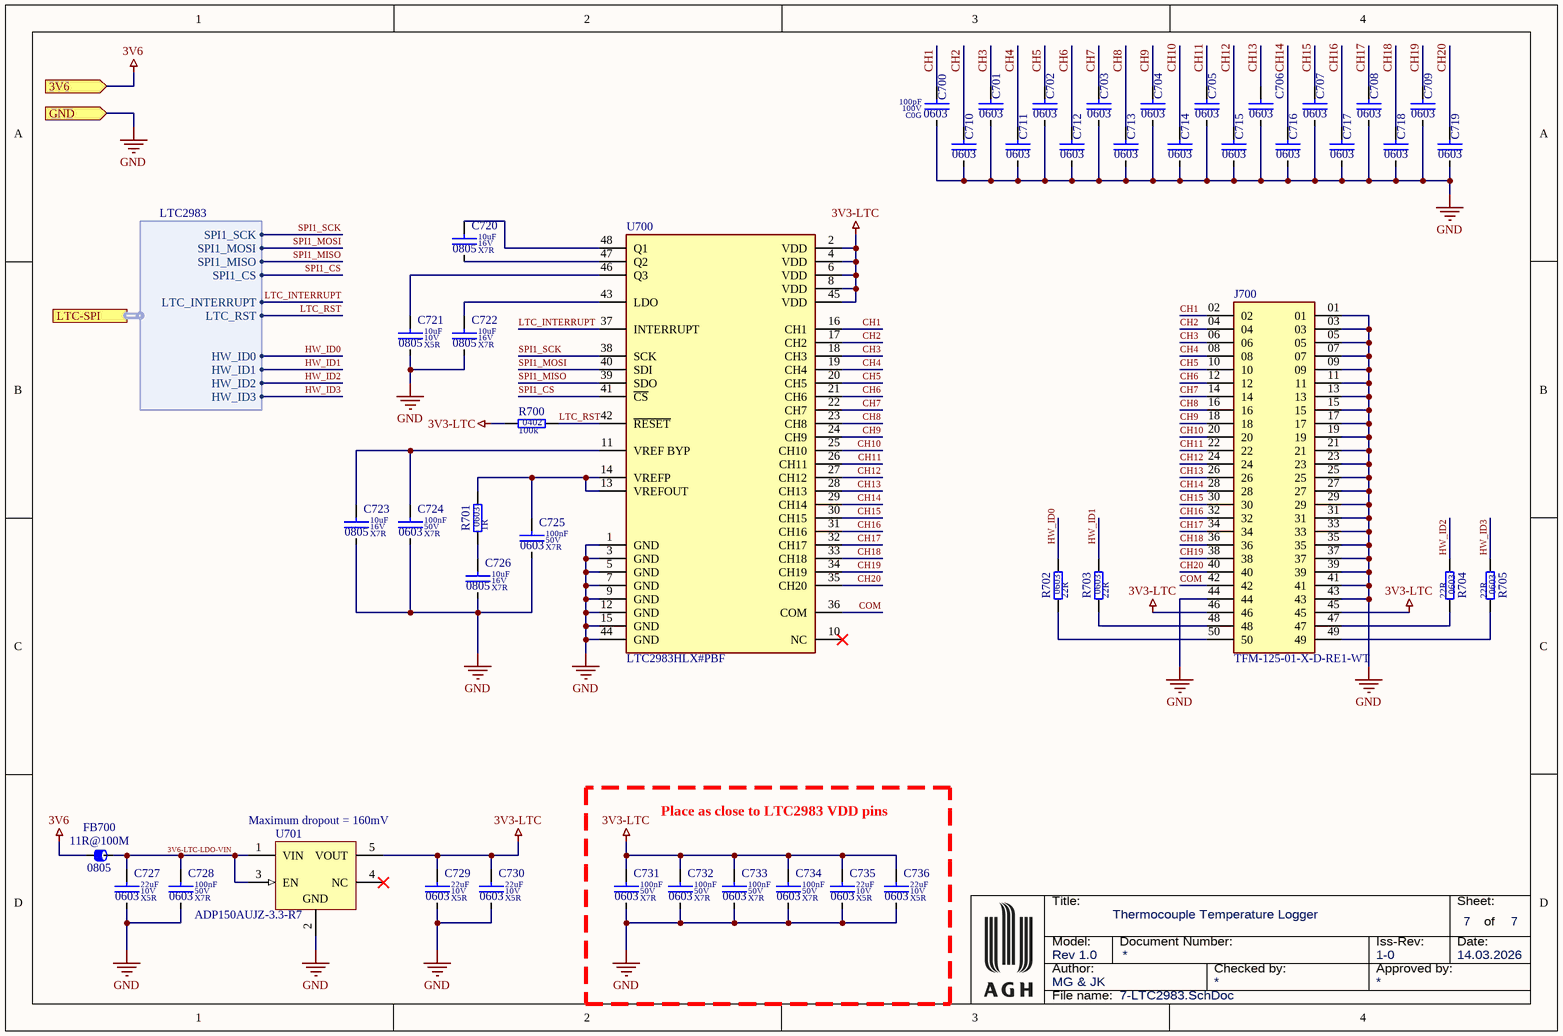
[diagram p6: 7-LTC2983.SchDoc]

### Parts
C700  value 100pF  Dielectric: C0G  Voltage: 100V  SCH_Footprint: 0603  [C_0603_1608]  (hidden comment: Ceramic C0G)
C701  SCH_Footprint: 0603  [C_0603_1608]  (hidden comment: Ceramic C0G)
C702  SCH_Footprint: 0603  [C_0603_1608]  (hidden comment: Ceramic C0G)
C703  SCH_Footprint: 0603  [C_0603_1608]  (hidden comment: Ceramic C0G)
C704  SCH_Footprint: 0603  [C_0603_1608]  (hidden comment: Ceramic C0G)
C705  SCH_Footprint: 0603  [C_0603_1608]  (hidden comment: Ceramic C0G)
C706  SCH_Footprint: 0603  [C_0603_1608]  (hidden comment: Ceramic C0G)
C707  SCH_Footprint: 0603  [C_0603_1608]  (hidden comment: Ceramic C0G)
C708  SCH_Footprint: 0603  [C_0603_1608]  (hidden comment: Ceramic C0G)
C709  SCH_Footprint: 0603  [C_0603_1608]  (hidden comment: Ceramic C0G)
C710  SCH_Footprint: 0603  [C_0603_1608]  (hidden comment: Ceramic C0G)
C711  SCH_Footprint: 0603  [C_0603_1608]  (hidden comment: Ceramic C0G)
C712  SCH_Footprint: 0603  [C_0603_1608]  (hidden comment: Ceramic C0G)
C713  SCH_Footprint: 0603  [C_0603_1608]  (hidden comment: Ceramic C0G)
C714  SCH_Footprint: 0603  [C_0603_1608]  (hidden comment: Ceramic C0G)
C715  SCH_Footprint: 0603  [C_0603_1608]  (hidden comment: Ceramic C0G)
C716  SCH_Footprint: 0603  [C_0603_1608]  (hidden comment: Ceramic C0G)
C717  SCH_Footprint: 0603  [C_0603_1608]  (hidden comment: Ceramic C0G)
C718  SCH_Footprint: 0603  [C_0603_1608]  (hidden comment: Ceramic C0G)
C719  SCH_Footprint: 0603  [C_0603_1608]  (hidden comment: Ceramic C0G)
C720  value 10uF  Dielectric: X7R  Voltage: 16V  SCH_Footprint: 0805  [C_0805_2012]  (hidden comment: Ceramic X7R)
C721  value 10uF  Dielectric: X5R  Voltage: 10V  SCH_Footprint: 0805  [C_0805_2012]  (hidden comment: Ceramic X5R)
C722  value 10uF  Dielectric: X7R  Voltage: 16V  SCH_Footprint: 0805  [C_0805_2012]  (hidden comment: Ceramic X7R)
C723  value 10uF  Dielectric: X7R  Voltage: 16V  SCH_Footprint: 0805  [C_0805_2012]  (hidden comment: Ceramic X7R)
C724  value 100nF  Dielectric: X7R  Voltage: 50V  SCH_Footprint: 0603  [C_0603_1608]  (hidden comment: Ceramic X7R)
C725  value 100nF  Dielectric: X7R  Voltage: 50V  SCH_Footprint: 0603  [C_0603_1608]  (hidden comment: Ceramic X7R)
C726  value 10uF  Dielectric: X7R  Voltage: 16V  SCH_Footprint: 0805  [C_0805_2012]  (hidden comment: Ceramic X7R)
C727  value 22uF  Dielectric: X5R  Voltage: 10V  SCH_Footprint: 0603  [C_0603_1608]  (hidden comment: Ceramic X5R)
C728  value 100nF  Dielectric: X7R  Voltage: 50V  SCH_Footprint: 0603  [C_0603_1608]  (hidden comment: Ceramic X7R)
C729  value 22uF  Dielectric: X5R  Voltage: 10V  SCH_Footprint: 0603  [C_0603_1608]  (hidden comment: Ceramic X5R)
C730  value 22uF  Dielectric: X5R  Voltage: 10V  SCH_Footprint: 0603  [C_0603_1608]  (hidden comment: Ceramic X5R)
C731  value 100nF  Dielectric: X7R  Voltage: 50V  SCH_Footprint: 0603  [C_0603_1608]  (hidden comment: Ceramic X7R)
C732  value 100nF  Dielectric: X7R  Voltage: 50V  SCH_Footprint: 0603  [C_0603_1608]  (hidden comment: Ceramic X7R)
C733  value 100nF  Dielectric: X7R  Voltage: 50V  SCH_Footprint: 0603  [C_0603_1608]  (hidden comment: Ceramic X7R)
C734  value 100nF  Dielectric: X7R  Voltage: 50V  SCH_Footprint: 0603  [C_0603_1608]  (hidden comment: Ceramic X7R)
C735  value 22uF  Dielectric: X5R  Voltage: 10V  SCH_Footprint: 0603  [C_0603_1608]  (hidden comment: Ceramic X5R)
C736  value 22uF  Dielectric: X5R  Voltage: 10V  SCH_Footprint: 0603  [C_0603_1608]  (hidden comment: Ceramic X5R)
FB700  value 11R@100M  SCH_Footprint: 0805  [FB_0805_2012]  (hidden comment: Ferrite bead)
J700  TFM-125-01-X-D-RE1-WT  [SAMTEC_TFM-125-01-X-D-RE1-WT]
R700  value 100k  SCH_Footprint: 0402  [R_0402_1005]  (hidden comment: Resistor)
R701  value 1R  SCH_Footprint: 0603  [R_0603_1608]  (hidden comment: Resistor)
R702  value 22R  SCH_Footprint: 0603  [R_0603_1608]  (hidden comment: Resistor)
R703  value 22R  SCH_Footprint: 0603  [R_0603_1608]  (hidden comment: Resistor)
R704  value 22R  SCH_Footprint: 0603  [R_0603_1608]  (hidden comment: Resistor)
R705  value 22R  SCH_Footprint: 0603  [R_0603_1608]  (hidden comment: Resistor)
U700  LTC2983HLX#PBF  [FP-LX-48-05-08-1760-MFG]
U701  ADP150AUJZ-3.3-R7  [ADI-UJ-5_M]

### Blocks framed on the sheet
Place as close to LTC2983 VDD pins: C731-C736

### Ports
3V6 (in, see 1-Block-diagram[4B], 3-Power-Supply[3B], 6-Connectors[1A]), GND (in, see 1-Block-diagram[4B], 2-STM32H563[2A], 3-Power-Supply[3A], 4-Ethernet[1A], 5-SD-Card[1A], 6-Connectors[1A]), LTC-SPI (harness LTC2983, see 1-Block-diagram[4B], 2-STM32H563[1C])

### Harnesses
LTC2983: SPI1_SCK, SPI1_MOSI, SPI1_MISO, SPI1_CS, HW_ID3, HW_ID2, HW_ID1, HW_ID0, LTC_INTERRUPT, LTC_RST

### Nets
3V3-LTC: C729.1 C730.1 C731.1 C732.1 C733.1 C734.1 C735.1 C736.1 J700.45 J700.46 R700.1 U700.2(VDD) U700.4(VDD) U700.6(VDD) U700.8(VDD) U700.45(VDD) U701.5(VOUT)
3V6: FB700.1 ; port 3V6
GND: C700.2 C701.2 C702.2 C703.2 C704.2 C705.2 C706.2 C707.2 C708.2 C709.2 C710.2 C711.2 C712.2 C713.2 C714.2 C715.2 C716.2 C717.2 C718.2 C719.2 C721.2 C722.2 C723.2 C724.2 C725.2 C726.2 C727.2 C728.2 C729.2 C730.2 C731.2 C732.2 C733.2 C734.2 C735.2 C736.2 J700.01 J700.03 J700.05 J700.07 J700.09 J700.11 J700.13 J700.15 J700.17 J700.19 J700.21 J700.23 J700.25 J700.27 J700.29 J700.31 J700.33 J700.35 J700.37 J700.39 J700.41 J700.43 J700.44 U700.1(GND) U700.3(GND) U700.5(GND) U700.7(GND) U700.9(GND) U700.12(GND) U700.15(GND) U700.44(GND) U701.2(GND) ; port GND
3V6-LTC-LDO-VIN: C727.1 C728.1 FB700.2 U701.1(VIN) U701.3(EN)  [project net 3V6-LTC-LDO-VIN_7]
CH1: C700.1 J700.02 U700.16(CH1)  [project net CH1_7]
CH2: C710.1 J700.04 U700.17(CH2)  [project net CH2_7]
CH3: C701.1 J700.06 U700.18(CH3)  [project net CH3_7]
CH4: C711.1 J700.08 U700.19(CH4)  [project net CH4_7]
CH5: C702.1 J700.10 U700.20(CH5)  [project net CH5_7]
CH6: C712.1 J700.12 U700.21(CH6)  [project net CH6_7]
CH7: C703.1 J700.14 U700.22(CH7)  [project net CH7_7]
CH8: C713.1 J700.16 U700.23(CH8)  [project net CH8_7]
CH9: C704.1 J700.18 U700.24(CH9)  [project net CH9_7]
CH10: C714.1 J700.20 U700.25(CH10)  [project net CH10_7]
CH11: C705.1 J700.22 U700.26(CH11)  [project net CH11_7]
CH12: C715.1 J700.24 U700.27(CH12)  [project net CH12_7]
CH13: C706.1 J700.26 U700.28(CH13)  [project net CH13_7]
CH14: C716.1 J700.28 U700.29(CH14)  [project net CH14_7]
CH15: C707.1 J700.30 U700.30(CH15)  [project net CH15_7]
CH16: C717.1 J700.32 U700.31(CH16)  [project net CH16_7]
CH17: C708.1 J700.34 U700.32(CH17)  [project net CH17_7]
CH18: C718.1 J700.36 U700.33(CH18)  [project net CH18_7]
CH19: C709.1 J700.38 U700.34(CH19)  [project net CH19_7]
CH20: C719.1 J700.40 U700.35(CH20)  [project net CH20_7]
COM: J700.42 U700.36(COM)  [project net COM_7]
HW_ID0: R702.2 ; port LTC-SPI.HW_ID0
HW_ID1: R703.2 ; port LTC-SPI.HW_ID1
HW_ID2: R704.2 ; port LTC-SPI.HW_ID2
HW_ID3: R705.2 ; port LTC-SPI.HW_ID3
LTC_INTERRUPT: U700.37(INTERRUPT) ; port LTC-SPI.LTC_INTERRUPT
LTC_RST: R700.2 U700.42(~{RESET}) ; port LTC-SPI.LTC_RST
SPI1_CS: U700.41(~{CS}) ; port LTC-SPI.SPI1_CS
SPI1_MISO: U700.39(SDO) ; port LTC-SPI.SPI1_MISO
SPI1_MOSI: U700.40(SDI) ; port LTC-SPI.SPI1_MOSI
SPI1_SCK: U700.38(SCK) ; port LTC-SPI.SPI1_SCK
NetC720_1: C720.1 U700.48(Q1)
NetC720_2: C720.2 U700.47(Q2)
NetC721_1: C721.1 U700.46(Q3)
NetC722_1: C722.1 U700.43(LDO)
NetC723_1: C723.1 C724.1 U700.11(VREF_BYP)
NetC725_1: C725.1 R701.2 U700.13(VREFOUT) U700.14(VREFP)
NetC726_1: C726.1 R701.1
NetJ700_47: J700.47 R704.1
NetJ700_48: J700.48 R703.1
NetJ700_49: J700.49 R705.1
NetJ700_50: J700.50 R702.1

Not connected (* = marked no-connect by the designer): U700 10(NC)*; U701 4(NC)*

### Notes on the sheet
- (near U701) Maximum dropout = 160mV
- Title:
- Sheet:
- of
- Author:
- Model:
- Document Number:
- Checked by:
- Iss-Rev:
- Approved by:
- Date:
- File name:

### Library data of the parts
C700 = C_100pF_100V_C0G_0603_5_AECQ1: Capacitor; Manufacturer: Murata; Manufacturer Part Number: GCM1885C2A101JA16D; Tolerance (%): 5; AEC-Q: 1; Part Number: C_100pF_100V_C0G_0603_5_AECQ1; HelpURL: https://www.murata.com/products/productdetail?partno=GCM1885C2A101JA16%23; Supplier 1: TME; Supplier Part Number 1: GCM1885C2A101JA16D; Supplier 2: RS Components; Supplier 3: Farnell; Supplier Part Number 3: 2688624; Supplier 4: Mouser; Supplier Part Number 4: 81-GCM1885C2A101JA6D; Supplier 5: Digi-Key; Supplier Part Number 5: 490-4771-1-ND; Supplier 6: LCSC; Supplier Part Number 6: C126576
C701-C719 = C_100pF_100V_C0G_0603_5_AECQ1: Capacitor; Manufacturer: Murata; Manufacturer Part Number: GCM1885C2A101JA16D; Voltage: 100V; Value: 100pF; Tolerance (%): 5; AEC-Q: 1; Dielectric: C0G; Part Number: C_100pF_100V_C0G_0603_5_AECQ1; HelpURL: https://www.murata.com/products/productdetail?partno=GCM1885C2A101JA16%23; Supplier 1: TME; Supplier Part Number 1: GCM1885C2A101JA16D; Supplier 2: RS Components; Supplier 3: Farnell; Supplier Part Number 3: 2688624; Supplier 4: Mouser; Supplier Part Number 4: 81-GCM1885C2A101JA6D; Supplier 5: Digi-Key; Supplier Part Number 5: 490-4771-1-ND; Supplier 6: LCSC; Supplier Part Number 6: C126576
C720 C722 C723 C726 = C_10uF_16V_X7R_0805_10: Capacitor; Manufacturer: Taiyo Yuden; Manufacturer Part Number: EMK212BB7106KG-T; Tolerance (%): 10; Part Number: C_10uF_16V_X7R_0805_10; HelpURL: https://www.mouser.pl/datasheet/2/396/mlcc02_e-1307760.pdf; Supplier 1: TME; Supplier 2: RS Components; Supplier 3: Farnell; Supplier 4: Mouser; Supplier Part Number 4: 963-EMK212BB7106KG-T; Supplier 5: Digi-Key; Supplier Part Number 5: 587-6139-1-ND; Supplier 6: LCSC
C721 = C_10uF_10V_X5R_0805_10: Capacitor; Manufacturer: Kemet; Manufacturer Part Number: C0805C106K8PACTU; Tolerance (%): 10; Part Number: C_10uF_10V_X5R_0805_10; HelpURL: https://www.mouser.pl/datasheet/2/447/KEM_C1006_X5R_SMD-3316465.pdf; Supplier 1: TME; Supplier Part Number 1: C0805C106K8PAC; Supplier 2: RS Components; Supplier Part Number 2: 8029850; Supplier 3: Farnell; Supplier Part Number 3: 1463362; Supplier 4: Mouser; Supplier Part Number 4: 80-C0805C106K8P; Supplier 5: Digi-Key; Supplier Part Number 5: 399-C0805C106K8PAC7800CT-ND; Supplier 6: LCSC
C724 C725 C728 C731-C734 = C_100nF_50V_X7R_0603_10_AECQ1: Capacitor; Manufacturer: Murata; Manufacturer Part Number: GCM188R71H104KA57D; Tolerance (%): 10; AEC-Q: 1; Part Number: C_100nF_50V_X7R_0603_10_AECQ1; HelpURL: https://www.murata.com/products/productdetail?partno=GCM188R71H104KA57%23; Supplier 1: TME; Supplier Part Number 1: GCM188R71H104KA57D; Supplier 2: RS Components; Supplier 3: Farnell; Supplier Part Number 3: 4360223; Supplier 4: Mouser; Supplier Part Number 4: 81-GCM188R71H104KA7D; Supplier 5: Digi-Key; Supplier Part Number 5: 490-4779-1-ND; Supplier 6: LCSC; Supplier Part Number 6: C85864
C727 C729 C730 C735 C736 = C_22uF_10V_X5R_0603_20: Capacitor; Manufacturer: Murata; Manufacturer Part Number: GRM188R61A226ME15D; Tolerance (%): 20; Part Number: C_22uF_10V_X5R_0603_20; HelpURL: https://www.mouser.pl/datasheet/2/281/1/GRM188R61A226ME15_02A-1985787.pdf; Supplier 1: TME; Supplier Part Number 1: GRM188R61A226ME15D; Supplier 2: RS Components; Supplier 3: Farnell; Supplier Part Number 3: 2426957; Supplier 4: Mouser; Supplier Part Number 4: 81-GRM188R61A226ME5D; Supplier 5: Digi-Key; Supplier Part Number 5: 490-10476-1-ND; Supplier 6: LCSC
FB700 = FB_2508051107Y0: Manufacturer: Fair-Rite; Current: 300mA; Resistance: 100mR; Part Number: FB_2508051107Y0; HelpURL: https://datasheet.octopart.com/2508051107Y0-Fair-Rite-datasheet-834.pdf; Manufacturer Part Number: 2508051107Y0; Supplier 1: TME; Supplier 2: RS Components; Supplier 3: Farnell; Supplier Part Number 3: 1612004; Supplier 4: Mouser; Supplier Part Number 4: 623-2508051107Y0; Supplier 5: Digi-Key; Supplier Part Number 5: 1934-1397-1-ND; Supplier 6: LCSC
J700 = TFM-125-01-X-D-RE1-WT: MF: Samtec; Package: None; Price: None; Value: *; MP: TFM-125-01-X-D-RE1-WT; Availability: Unavailable
R700 = R_100k_0402_1: Manufacturer: Yageo; Manufacturer Part Number: RC0402FR-07100KL; Voltage: 50V; Power: 63mW; Tolerance: 1%; Part Number: R_100k_0402_1; HelpURL: http://www.tme.eu/pl/Document/1a2bc76e2be68b3b1670068306778ce6/rc0402yageo.pdf; Supplier 1: TME; Supplier Part Number 1: RC0402FR-07100K; Supplier 2: RS Components; Supplier 3: Farnell; Supplier Part Number 3: 2131798; Supplier 4: Mouser; Supplier Part Number 4: 603-RC0402FR-07100KL; Supplier 5: Digi-Key; Supplier Part Number 5: 311-100KLRCT-ND; Supplier 6: LCSC
R701 = R_1R_0603_1: Manufacturer: Yageo; Manufacturer Part Number: RC0603FR-071RL; Voltage: 50V; Power: 100mW; Tolerance: 1%; Part Number: R_1R_0603_1; HelpURL: http://www.tme.eu/en/Document/9fef8ccbb584e9f6a1c931cf356afd5c/PYu-RC0603_51_RoHS_L_4.pdf; Supplier 1: TME; Supplier Part Number 1: RC0603FR-071R; Supplier 2: RS Components; Supplier 3: Farnell; Supplier Part Number 3: 9238123; Supplier 4: Mouser; Supplier Part Number 4: 603-RC0603FR-071RL; Supplier 5: Digi-Key; Supplier Part Number 5: 311-1.00HRCT-ND; Supplier 6: LCSC
R702-R705 = R_22R_0603_5: Manufacturer: Walsin; Manufacturer Part Number: WF06P220JTL; Voltage: 50V; Power: 125mW; Tolerance: 5%; Part Number: R_22R_0603_5; HelpURL: http://www.tme.eu/pl/Document/b315665a56acbc42df513c99b390ad98/ROYALOHM-THICKFILM.pdf; Supplier 1: TME; Supplier Part Number 1: WF06P-22R-5%; Supplier 2: RS Components; Supplier 3: Farnell; Supplier 4: Mouser; Supplier 5: Digi-Key; Supplier 6: LCSC
U700 = CMP-09104-000007-1: MULTI SENSOR HIGH ACCURACY DIGIT; Min Supply Voltage: 2.85V; Max Supply Voltage: 5.25V; Output Type: SPI; Number of Pins: 48; REACH SVHC: No SVHC; Mount: Surface Mount; Case/Package: LQFP; Max Operating Temperature: 125°C; RoHS Compliant: Yes; Series: -; Min Operating Temperature: -40°C; Packaging: Tray
U701 = CMP-0786-00394-1: Ultralow Noise, 150 mA CMOS Linear Regulator, 2.2 to 5.5 V Vin, 3.3 V Vout, Industrial, 5-pin SOT23 (UJ-5), Reel; Manufacturer: Analog Devices; Supply Current IGND @ Small Load: 10uA; Vin (min) (V): 2.2; Iout max: 150mA; Preset Vout Values (V): 3.3; Vin (max) (V): 5.5; ComponentLink2Description: Datasheet; PackageReference: UJ-5; DatasheetVersion: Rev. A; PackageDescription: 5-Pin Thin Small Outline Transistor Package, Body 2.9 x 1.6 mm, Pitch 0.95 mm; ComponentLink4URL: Product URL:http://www.analog.com/en/ADP150/productSearch.html; Packing: Reel; ComponentLink1URL: http://www.analog.com/en/index.html; PartNumber: ADP150AUJZ-3.3-R7; PackageVersion: 100708-A, 10/2008; ComponentLink3Description: Package Specification; ComponentLink3URL: http:/www.analog.com/static/imported-files/packages/PKG_PDF/TSOT(UJ)/UJ_5.pdf; ComponentLink4Description: URL Link1; ComponentLink2URL: http://www.analog.com/static/imported-files/data_sheets/ADP150.pdf; Code_JEDEC: MO-193-AB; Mounting Technology: Surface Mount; ComponentLink1Description: Manufacturer URL

## Nets that join several sheets
3V6: 3-Power-Supply (8 pins), 6-Connectors (C501.1 J500.2), 7-LTC2983 (FB700.1)
5V-PS: 3-Power-Supply (9 pins), 6-Connectors (C502.1 J500.16)
GND: 2-STM32H563 (48 pins), 3-Power-Supply (31 pins), 4-Ethernet (24 pins), 5-SD-Card (10 pins), 6-Connectors (13 pins), 7-LTC2983 (68 pins)
VDD-3V3: 2-STM32H563 (C130.1 FB100.1 P100.1), 3-Power-Supply (7 pins), 4-Ethernet (10 pins), 5-SD-Card (5 pins), 6-Connectors (7 pins)
ENC-BUT: 2-STM32H563 (U100.98), 6-Connectors (R516.1)
ENC-CH1: 2-STM32H563 (U100.96), 6-Connectors (R514.1)
ENC-CH2: 2-STM32H563 (U100.97), 6-Connectors (R515.1)
HW_ID0: 2-STM32H563 (U100.10), 7-LTC2983 (R702.2)
HW_ID1: 2-STM32H563 (U100.11), 7-LTC2983 (R703.2)
HW_ID2: 2-STM32H563 (U100.12), 7-LTC2983 (R704.2)
HW_ID3: 2-STM32H563 (U100.13), 7-LTC2983 (R705.2)
I2C1_SCL: 2-STM32H563 (U100.136), 6-Connectors (R506.1)
I2C1_SDA: 2-STM32H563 (U100.137), 6-Connectors (R507.1)
LTC_INTERRUPT: 2-STM32H563 (U100.119), 7-LTC2983 (U700.37)
LTC_RST: 2-STM32H563 (U100.118), 7-LTC2983 (R700.2 U700.42)
NetR104_1: 2-STM32H563 (R104.1), 4-Ethernet (U300.17)
NetR105_1: 2-STM32H563 (R105.1), 4-Ethernet (U300.18)
RMII_CRS_DV: 2-STM32H563 (U100.43), 4-Ethernet (R305.2)
RMII_MDC: 2-STM32H563 (U100.27), 4-Ethernet (R314.2 U300.13)
RMII_MDIO: 2-STM32H563 (U100.36), 4-Ethernet (R315.2 U300.12)
RMII_REF_CLK: 2-STM32H563 (U100.35), 4-Ethernet (R304.2)
RMII_RXD0: 2-STM32H563 (U100.44), 4-Ethernet (R306.2)
RMII_RXD1: 2-STM32H563 (U100.45), 4-Ethernet (R307.2)
RMII_TX_EN: 2-STM32H563 (U100.126), 4-Ethernet (U300.16)
SD-Detect: 2-STM32H563 (U100.7), 5-SD-Card (CON400.9 FL400.1)
SDMMC1_CK: 2-STM32H563 (U100.113), 5-SD-Card (FL400.6)
SDMMC1_CMD: 2-STM32H563 (U100.116), 5-SD-Card (FL400.5)
SDMMC1_D0: 2-STM32H563 (U100.102), 5-SD-Card (FL400.7)
SDMMC1_D1: 2-STM32H563 (U100.99), 5-SD-Card (FL400.8)
SDMMC1_D2: 2-STM32H563 (U100.111), 5-SD-Card (FL400.3)
SDMMC1_D3: 2-STM32H563 (U100.112), 5-SD-Card (FL400.4)
SPI1_CS: 2-STM32H563 (U100.122), 7-LTC2983 (U700.41)
SPI1_MISO: 2-STM32H563 (U100.124), 7-LTC2983 (U700.39)
SPI1_MOSI: 2-STM32H563 (U100.123), 7-LTC2983 (U700.40)
SPI1_SCK: 2-STM32H563 (U100.41), 7-LTC2983 (U700.38)
SPI2_CS: 2-STM32H563 (U100.73), 6-Connectors (R505.1)
SPI2_MISO: 2-STM32H563 (U100.28), 6-Connectors (R504.1)
SPI2_MOSI: 2-STM32H563 (U100.29), 6-Connectors (R503.1)
SPI2_SCK: 2-STM32H563 (U100.69), 6-Connectors (R502.1)
USER-BUTTON1: 2-STM32H563 (U100.63), 6-Connectors (R508.1)
USER-BUTTON2: 2-STM32H563 (U100.64), 6-Connectors (R509.1)
USER-BUTTON3: 2-STM32H563 (U100.65), 6-Connectors (R510.1)
USER-BUTTON4: 2-STM32H563 (U100.66), 6-Connectors (R511.1)
USER-BUTTON5: 2-STM32H563 (U100.67), 6-Connectors (R512.1)
USER-BUTTON6: 2-STM32H563 (U100.68), 6-Connectors (R513.1)
USER-LED0: 2-STM32H563 (U100.58), 6-Connectors (R517.1)
USER-LED1: 2-STM32H563 (U100.59), 6-Connectors (R518.1)
USER-LED2: 2-STM32H563 (U100.60), 6-Connectors (R519.1)